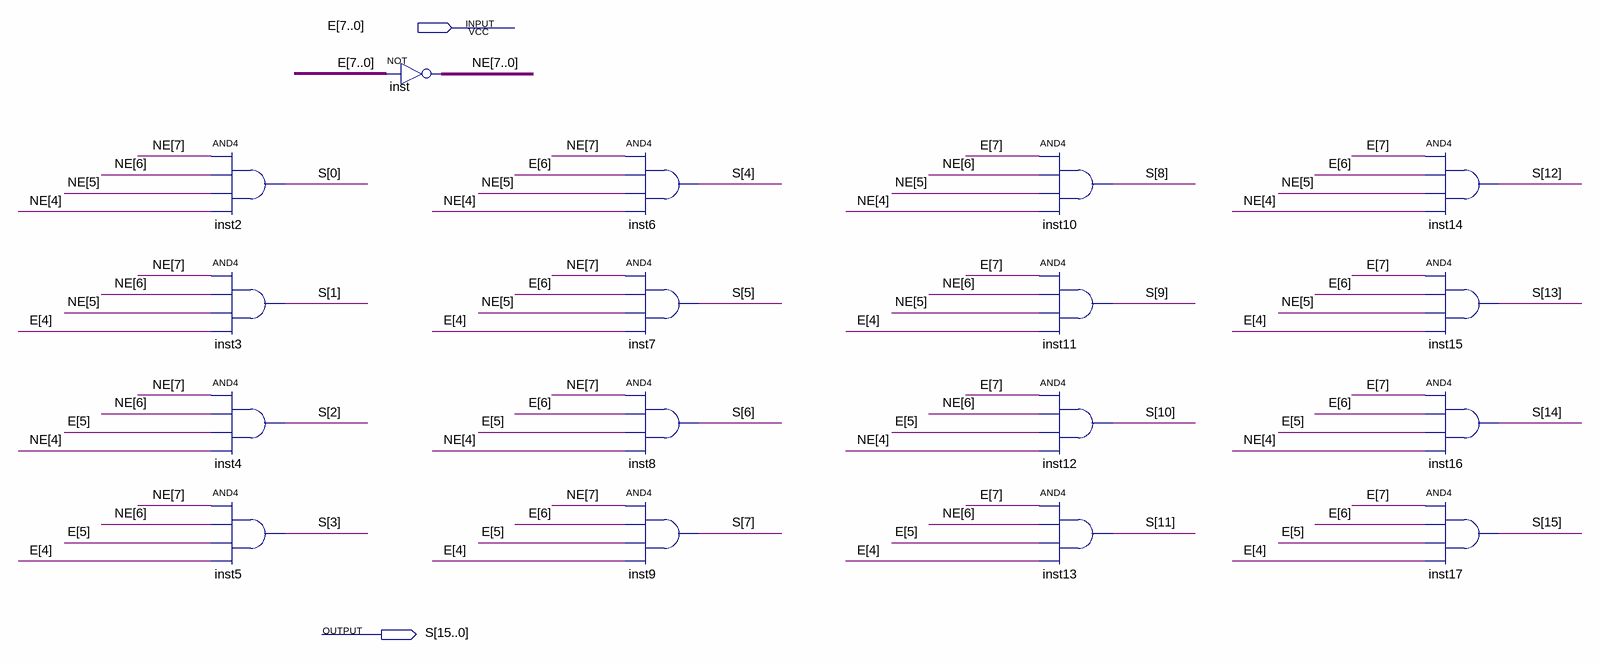
[diagram p0: schematic sheet]
// Quartus schematic DECOD4b16b.bdf as structural Verilog: 17 symbols, 2 pins
module DECOD4b16b (
  input  [7:0] E,
  output [15:0] S
);

  wire [7:0] NE;

  and inst2 (S[0], NE[7], NE[6], NE[5], NE[4]);
  and inst3 (S[1], NE[7], NE[6], NE[5], E[4]);
  and inst4 (S[2], NE[7], NE[6], E[5], NE[4]);
  and inst5 (S[3], NE[7], NE[6], E[5], E[4]);
  assign NE = ~E;  // NOT inst, 8 bits wide
  and inst6 (S[4], NE[7], E[6], NE[5], NE[4]);
  and inst7 (S[5], NE[7], E[6], NE[5], E[4]);
  and inst8 (S[6], NE[7], E[6], E[5], NE[4]);
  and inst9 (S[7], NE[7], E[6], E[5], E[4]);
  and inst10 (S[8], E[7], NE[6], NE[5], NE[4]);
  and inst11 (S[9], E[7], NE[6], NE[5], E[4]);
  and inst12 (S[10], E[7], NE[6], E[5], NE[4]);
  and inst13 (S[11], E[7], NE[6], E[5], E[4]);
  and inst14 (S[12], E[7], E[6], NE[5], NE[4]);
  and inst15 (S[13], E[7], E[6], NE[5], E[4]);
  and inst16 (S[14], E[7], E[6], E[5], NE[4]);
  and inst17 (S[15], E[7], E[6], E[5], E[4]);
endmodule
